# EAGLE design LD1086_30V_to_1V8 (EAGLE 7.2.0)
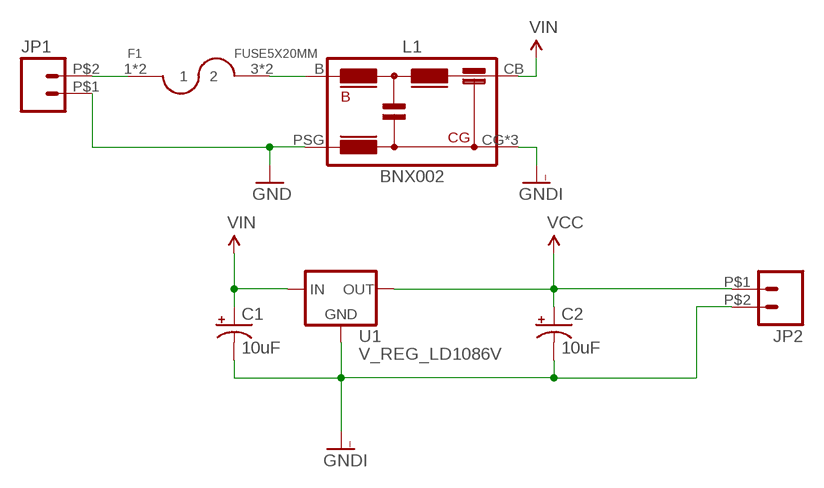
[diagram p0: schematic, sheet 1]

## Parts
C1  10uF  10UF-50V-10%(PTH)  [KEMET_E]
C2  10uF  10UF-50V-10%(PTH)  [KEMET_E]
F1  FUSE5X20MM  [FUSE_1A3399]
JP1  M02TE-282834-2  [1X02_282834-2]
JP2  M02TE-282834-2  [1X02_282834-2]
L1  BNX002  [BNX002]
U1  V_REG_LD1086V  [TO-220-SINGLE]

## Nets
GND: JP1.P$1 L1.PSG
GNDI: C1.- C2.- JP2.P$2 L1.CG L1.CG1(CG) L1.CG2(CG) U1.GND
N$1: F1.3 F1.4 L1.B
N$2: F1.1 F1.2 JP1.P$2
VCC: C2.+ JP2.P$1 U1.OUT
VIN: C1.+ L1.CB U1.IN

## Library data of the parts
C1 C2 = 1V8:10UF-50V-10%(PTH): CAP-08440
F1 = 1V8:FUSE5
JP1 JP2 = DensityAltitude:M02: Standard 2-pin 0.1" header. Use with - straight break away headers ( PRT-00116) - right angle break away headers (PRT-00553) - swiss pins (PRT-00743) - machine pins (PRT-00117) - female headers (PRT-00115) Molex polarized connector foot print use with: PRT-08233 with associated crimp pins and housings. 2.54_SCREWTERM for use with PRT-10571. 3.5mm Screw Terminal footprints for PRT-08084 5mm Screw Terminal footprints for use with PRT-08432
L1 = 1V8:BNX002: FILTER
U1 = 1V8:V_REG_LD1086: LD1086 1.5 A adjustable and fixed low drop positive voltage regulator The LD1086 is a low drop voltage regulator capable of providing up to 1.5 A of output current. Dropout is guaranteed at a maximum of 1.2 V at the maximum output current, decreasing at lower loads. The LD1086 is pin-to-pin compatible with older 3-terminal adjustable regulators, but has better performance in terms of drop and output tolerance. Unlike PNP regulators, where a part of the output current is wasted as quiescent current, the LD1086 quiescent current flows into the load, increasing efficiency. Only a 10 μF (minimum) capacitor is needed for stability. The device is available in a TO-220, D²PAK, D²PAK/A, DPAK or DFN8 (4x4 mm) package. On-chip trimming allows the regulator to reach a very tight output voltage tolerance; within ± 1% at 25 °C. The LD1086 is available as automotive grade for adjustable output voltages in the TO-220 and DPAK packages. The PAT, SYL, SBL statistical tests have been performed, and the devices are qualified according to the AEC-Q100 specification for the automotive market in the temperature range of - 40 °C to 125 °C. Available Packages TO-220 D2PAK D2PAK/A - 3-pin w/ tabs, SMD DPAK DFN8

## Board
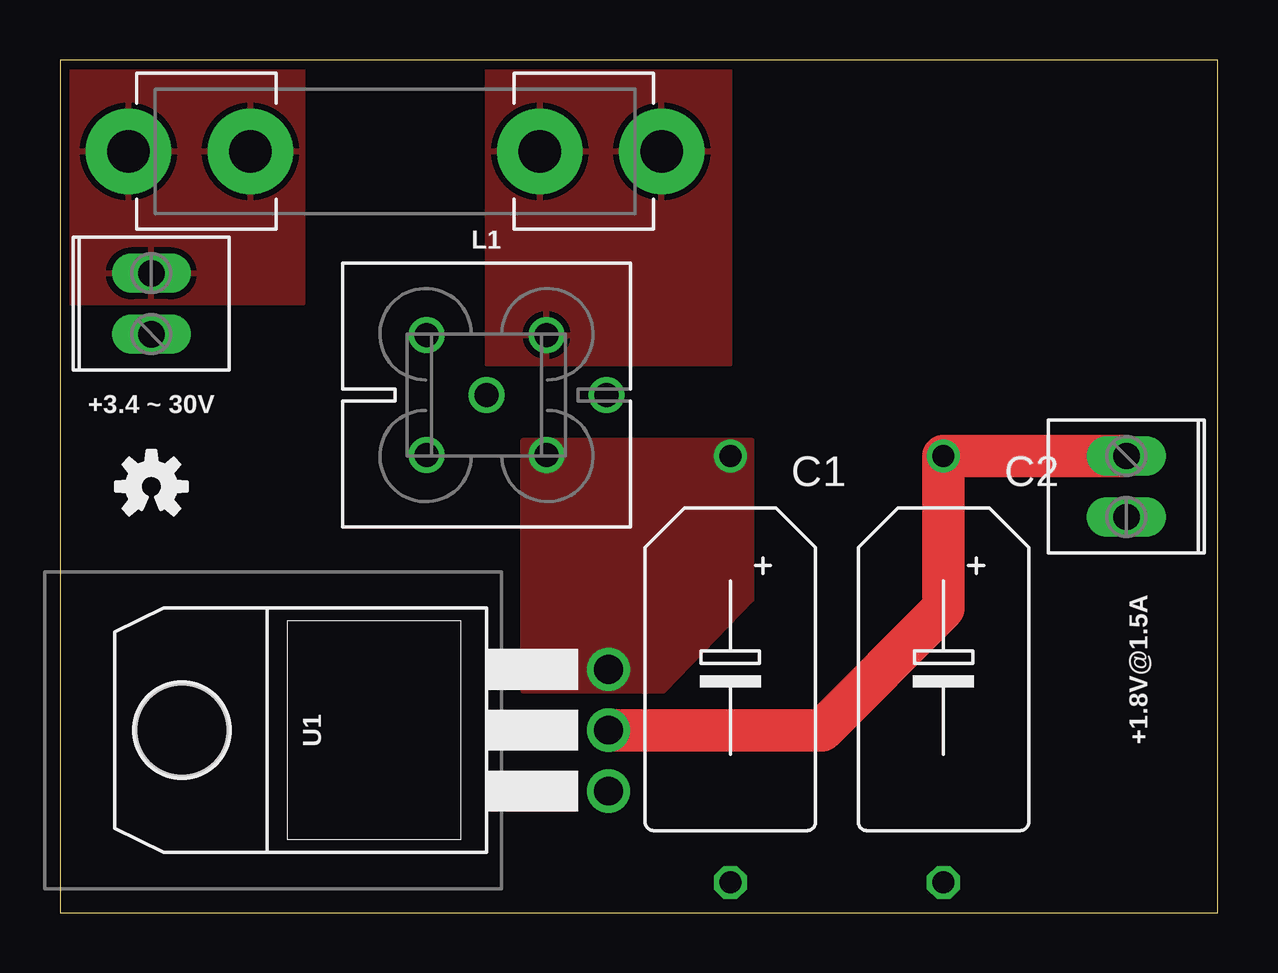
[diagram p1: board, top side]
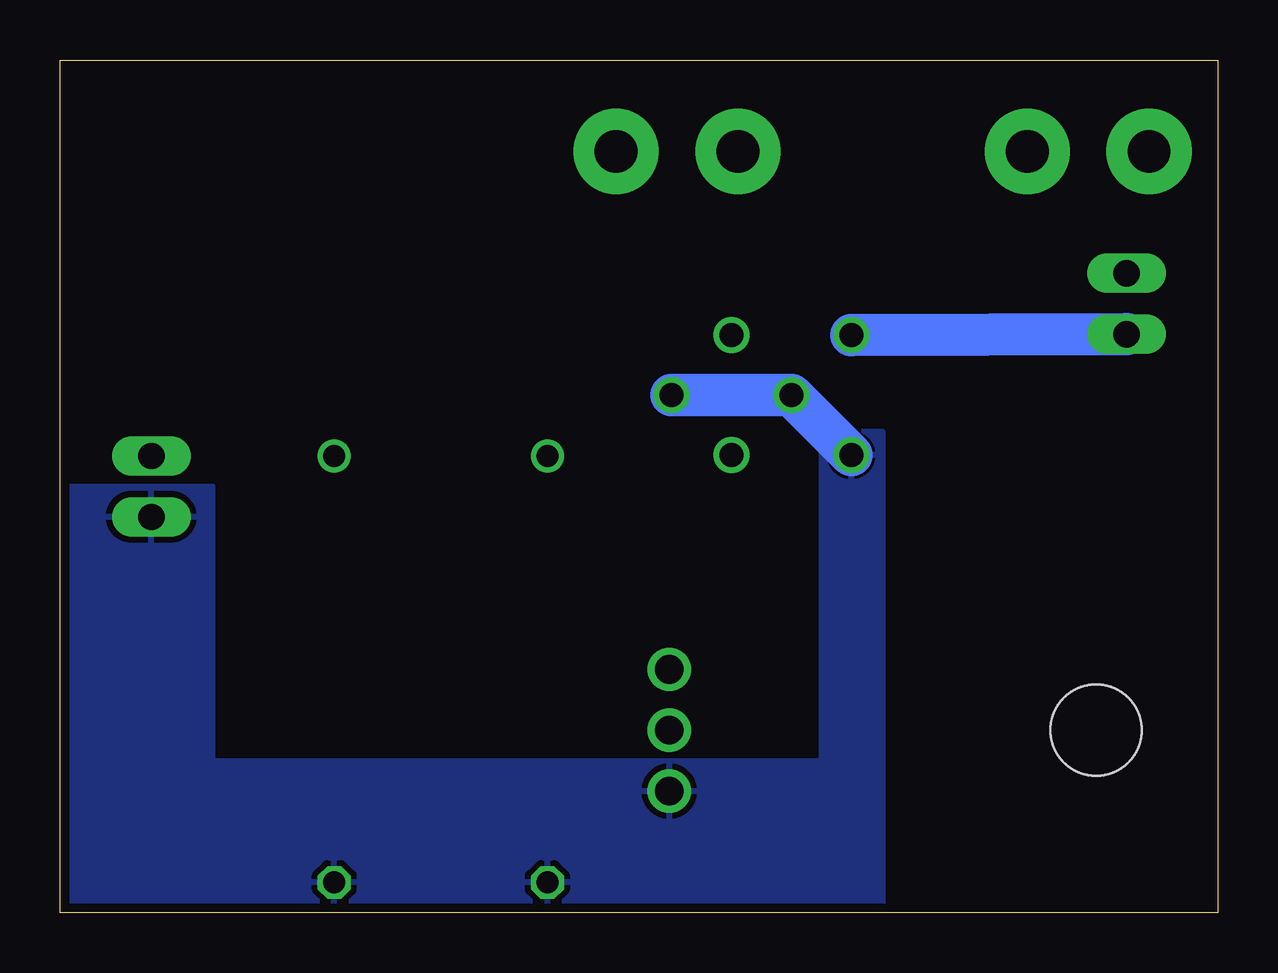
[diagram p2: board, bottom side, seen from below]

Size 48.26 x 35.56 mm. Coordinates in mm from the lower left corner, seen from the top.
Outline: 0,0 48.26,0 48.26,35.56 0,35.56 0,0
Copper layers (1*16): Top 0.0356mm / dielectric 1.5011mm / Bottom 0.0356mm
Design rules "oshpark-2layer": minimum track width 6mil, minimum drill 13mil, track to track 6mil, track to pad 6mil, pad to pad 6mil, via to via 6mil, smd to smd 6mil, copper to edge 15mil, drill to drill 6mil, minimum pad ring 7mil, minimum via ring 7mil, stop-mask expansion 4mil, vias tented up to drill 0mil, thermal gap 10mil

### Footprints (pad centres in the part's own frame; a part is rotated, then mirrored left to right if it is on the bottom)
KEMET_E = drill 0.914: + -8.89,0 | drill 0.914 octagon: - 8.89,0
FUSE_1A3399 = drill 1.778 pad 3.556: 1 0,-11.113; 2 0,-6.032; 3 0,6.032; 4 0,11.113
1X02_282834-2 = drill 1.1 long: P$1 -1.27,0; P$2 1.27,0
BNX002 = drill 1: B 2.5,2.5; CB 2.5,-2.5; CG -2.5,-2.5; CG1 0,0; CG2 5,0; PSG -2.5,2.5
TO-220-SINGLE = drill 1.2: GND -2.54,-17.78; IN 2.54,-17.78; OUT 0,-17.78 | hole 3.8: 0,0

### Placement (x,y rotation side)
C1  27.94,10.16 270 top
C2  36.83,10.16 270 top
F1  13.97,31.75 270 top
JP1  3.81,25.4 90 top
JP2  44.45,17.78 270 top
L1  17.78,21.59 0 top
U1  5.08,7.62 90 top
U$1  [OSHW-LOGO-S]  3.81,17.78 0 top

### Tracks (layer width: path | path; a pad name or v marks a point on that pad's centre or on a via)
GND
  Bottom 1.778: JP1.P$1 L1.PSG
GNDI
  Bottom 1.778: L1.CG2 L1.CG1 L1.CG
  pour Bottom: 13.97,0 48.26,0 48.26,17.78 41.91,17.78 41.91,6.35 16.51,6.35 16.51,20.07 13.97,20.07
N$1
  pour Top: 17.78,35.56 17.78,22.86 27.94,22.86 27.94,35.56
N$2
  pour Top: 0,35.56 10.16,35.56 10.16,25.4 0,25.4
VCC
  Top 1.778: U1.OUT 31.75,7.62 36.83,12.7 C2.+ JP2.P$1
VIN
  pour Top (no thermals): 19.3,9.27 25.15,9.27 28.83,13.08 28.83,19.68 19.3,19.68

### Text on the board
tPlace: +3.4 ~ 30V | +1.8V@1.5A